# Altium schematic sheet LB-word-MCU.SchDoc
size A
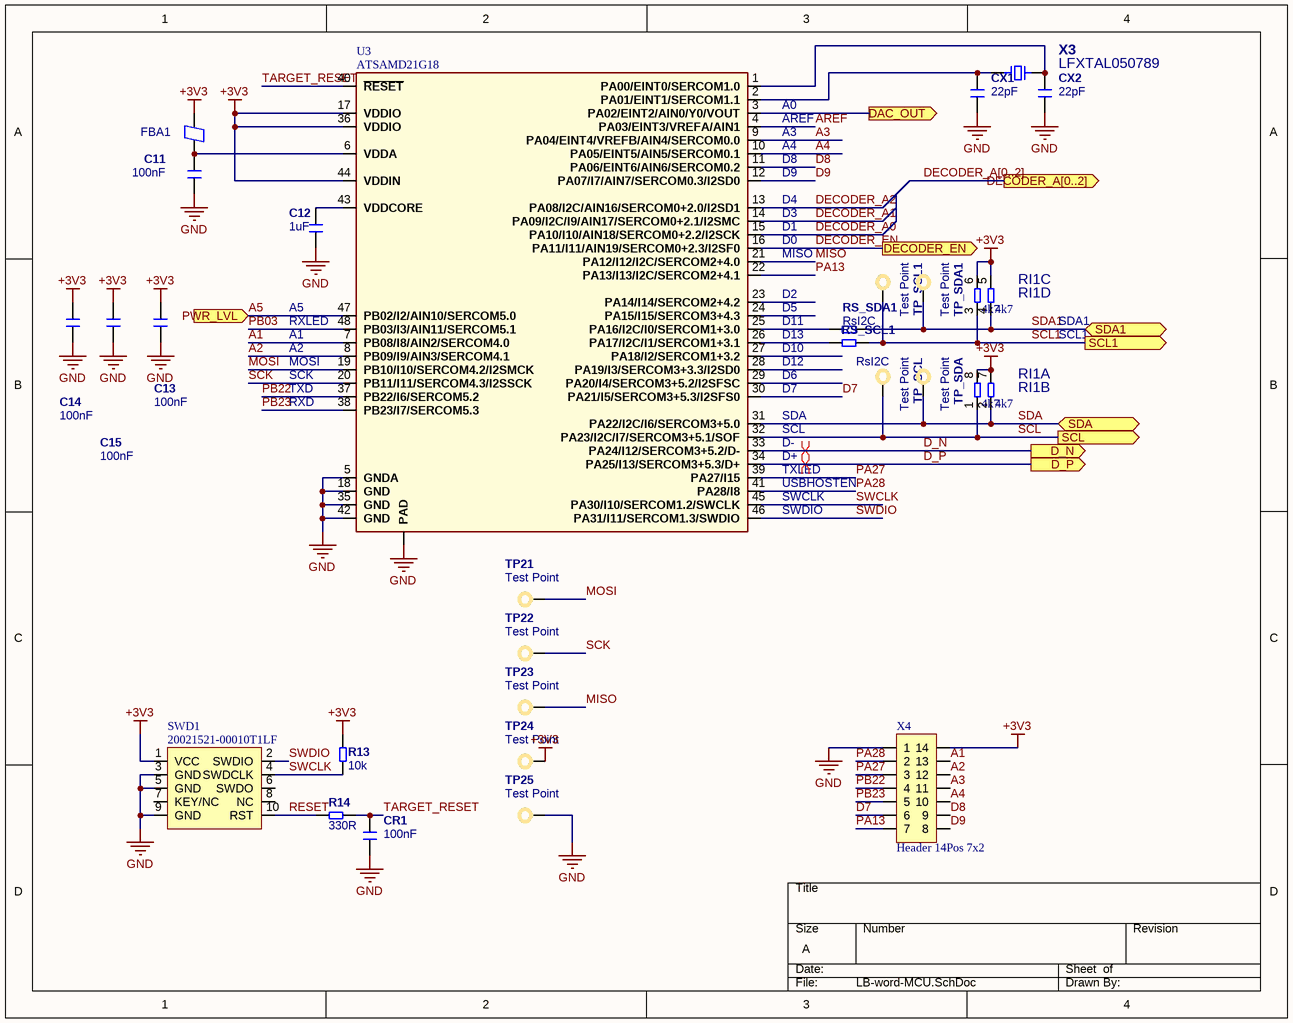
[diagram p0: LB-word-MCU.SchDoc]

## Parts
C11  100nF  [C0603_N]
C12  1uF  [C0603_N]
C13  100nF  [C0603_N]
C14  100nF  [C0603_N]
C15  100nF  [C0603_N]
CR1  100nF  [C0603_N]
CX1  22pF  [C0603_N]
CX2  22pF  [C0603_N]
FBA1  FB  [F0603_N]  (value not drawn)
R13  10k  [R0603]
R14  330R  [R0603]
RI1  value 4k7  [YC164]  (parts A,B,C,D of 4)
RS_SCL1  RsI2C  [R0603]
RS_SDA1  RsI2C  [R0603]
SWD1  20021521-00010T1LF  [Header 10P 50mil]
TP21  Test Point  [TestPoint-1.2mm]
TP22  Test Point  [TestPoint-1.2mm]
TP23  Test Point  [TestPoint-1.2mm]
TP24  Test Point  [TestPoint-1.2mm]
TP25  Test Point  [TestPoint-1.2mm]
TP_SCL  Test Point  [TestPoint-1.2mm]
TP_SCL1  Test Point  [TestPoint-1.2mm]
TP_SDA  Test Point  [TestPoint-1.2mm]
TP_SDA1  Test Point  [TestPoint-1.2mm]
U3  ATSAMD21G18  [QFN48_M]
X3  LFXTAL050789  [Crystal 0805]
X4  Header 14Pos 7x2  [Header 7x2 SMD 2.54mm]

## Ports
D_N (out), D_P (out), DAC_OUT (out), DECODER_A[0..2] (out), DECODER_EN (out), PWR_LVL (in), SCL1 (out), SCL (out), SDA1 (bidir), SDA (bidir)

## Nets
+3V3: C13.1 C14.1 C15.1 FBA1.2 R13.2 RI1.5 RI1.6 RI1.7 RI1.8 SWD1.1(VCC) TP24.1 U3.17(VDDIO) U3.36(VDDIO) U3.44(VDDIN) X4.14
GND: C11.2 C12.2 C13.2 C14.2 C15.2 CR1.2 CX1.2 CX2.2 SWD1.3(GND) SWD1.5(GND) SWD1.9(GND) TP25.1 U3.5(GNDA) U3.18(GND) U3.35(GND) U3.42(GND) U3.49(PAD) X4.1
A1: U3.7(PB08/I8/AIN2/SERCOM4.0) X4.13
A2: U3.8(PB09/I9/AIN3/SERCOM4.1) X4.12
A3: U3.9(PA04/EINT4/VREFB/AIN4/SERCOM0.0) X4.11
A4: U3.10(PA05/EINT5/AIN5/SERCOM0.1) X4.10
A5: U3.47(PB02/I2/AIN10/SERCOM5.0) ; port PWR_LVL
AREF: U3.4(PA03/EINT3/VREFA/AIN1)
D7: U3.30(PA21/I5/SERCOM3+5.3/I2SFS0) X4.6
D8: U3.11(PA06/EINT6/AIN6/SERCOM0.2) X4.9
D9: U3.12(PA07/I7/AIN7/SERCOM0.3/I2SD0) X4.8
D_N: U3.33(PA24/I12/SERCOM3+5.2/D-) ; port D_N
D_P: U3.34(PA25/I13/SERCOM3+5.3/D+) ; port D_P
DAC_OUT: U3.3(PA02/EINT2/AIN0/Y0/VOUT) ; port DAC_OUT
DECODER_A0: U3.15(PA10/I10/AIN18/SERCOM0+2.2/I2SCK)
DECODER_A1: U3.14(PA09/I2C/I9/AIN17/SERCOM0+2.1/I2SMC)
DECODER_A2: U3.13(PA08/I2C/AIN16/SERCOM0+2.0/I2SD1)
DECODER_EN: U3.16(PA11/I11/AIN19/SERCOM0+2.3/I2SF0) ; port DECODER_EN
MISO: TP23.1 U3.21(PA12/I12/I2C/SERCOM2+4.0)
MOSI: TP21.1 U3.19(PB10/I10/SERCOM4.2/I2SMCK)
PA13: U3.22(PA13/I13/I2C/SERCOM2+4.1) X4.7
PA27: U3.39(PA27/I15) X4.3
PA28: U3.41(PA28/I8) X4.2
PB03: U3.48(PB03/I3/AIN11/SERCOM5.1)
PB22: U3.37(PB22/I6/SERCOM5.2) X4.4
PB23: U3.38(PB23/I7/SERCOM5.3) X4.5
RESET: R14.1 SWD1.10(RST)
SCK: TP22.1 U3.20(PB11/I11/SERCOM4.3/I2SSCK)
SCL: RI1.1 TP_SCL.1 U3.32(PA23/I2C/I7/SERCOM3+5.1/SOF) ; port SCL
SCL1: RI1.3 RS_SCL1.2 TP_SCL1.1 ; port SCL1
SDA: RI1.2 TP_SDA.1 U3.31(PA22/I2C/I6/SERCOM3+5.0) ; port SDA
SDA1: RI1.4 RS_SDA1.2 TP_SDA1.1 ; port SDA1
SWCLK: R13.1 SWD1.4(SWDCLK) U3.45(PA30/I10/SERCOM1.2/SWCLK)
SWDIO: SWD1.2(SWDIO) U3.46(PA31/I11/SERCOM1.3/SWDIO)
TARGET_RESET: CR1.1 R14.2 U3.40(~{RESET})
NetC11_1: C11.1 FBA1.1 U3.6(VDDA)
NetC12_1: C12.1 U3.43(VDDCORE)
NetCX1_1: CX1.1 U3.2(PA01/EINT1/SERCOM1.1) X3.1
NetCX2_1: CX2.1 U3.1(PA00/EINT0/SERCOM1.0) X3.2
NetRS_SCL1_1: RS_SCL1.1 U3.26(PA17/I2C/I1/SERCOM1+3.1)
NetRS_SDA1_1: RS_SDA1.1 U3.25(PA16/I2C/I0/SERCOM1+3.0)

Not connected (* = marked no-connect by the designer): SWD1 6(SWDO) 7(KEY/NC) 8(NC); U3 23(PA14/I14/SERCOM2+4.2) 24(PA15/I15/SERCOM3+4.3) 27(PA18/I2/SERCOM1+3.2) 28(PA19/I3/SERCOM3+3.3/I2SD0) 29(PA20/I4/SERCOM3+5.2/I2SFSC)

## Buses and harness runs
bus DECODER_A[0..2] = port DECODER_A[0..2]

## Layout directives
differential pair: D_N, D_P

## Notes on the sheet
- SDA1
- SCL1
- (in symbol ATSAMD21G18) A0; AREF; A3; A4; D8; D9; D4; D3; D1; D0; MISO; D2; A5; D5; RXLED; D11; A1; D13; A2; D10; MOSI; D12; SCK; D6; TXD; D7; RXD; SDA; SCL; D-; D+; TXLED; USBHOSTEN; SWCLK; SWDIO

## Library data of the parts
C11-C15 CR1 CX1 CX2 = Capacitor: Capacitor MLCC; Manufacturer: Yageo; Manufacturer Part Number: CC0603KRX7R9BB104; Tolerance (%): 10; Category: Capacitor; Package: 0603; Supplier Part Number 1: 1362556; Supplier 1: Farnell; ComponentLink1URL: http://www.yageo.com; ComponentLink1Description: Manufacturer Website; Voltage Rating (Volts): *; Supplier 2: Digi-Key; Supplier Part Number 2: 311-1344-1-ND
  C11 C13-C15 CR1: Value: 100nF
  C12: Value: 1uF
  CX1 CX2: Value: 22pF
FBA1 = Ferrite Bead
R13 R14 RS_SCL1 RS_SDA1 = Resistor: Published: 17-Dec-2003; LatestRevisionDate: 19-Mar-2004; LatestRevisionNote: Silkscreen size reduced.; PackageDocument: Mar-2003; PackageReference: 3-0603; Publisher: Altium Limited; Code_IPC: 1608 [0603]; ComponentLink1Description: Manufacturer Link; ComponentLink1URL: http://www.panasonic.com/industrial/components/resistive_products.htm; ComponentLink2Description: Datasheet; ComponentLink2URL: http://www.panasonic.com/industrial/components/pdf/AOA0000CE2.pdf
  R13: Value: 10k
  R14: Value: 330R
  RS_SCL1 RS_SDA1: Value: RsI2C
RI1 = Resistor Array - 4P
SWD1 = SWD
X3 = Crystal: Value: LFXTAL050789